# Altium schematic sheet Sensor.SchDoc
size A4
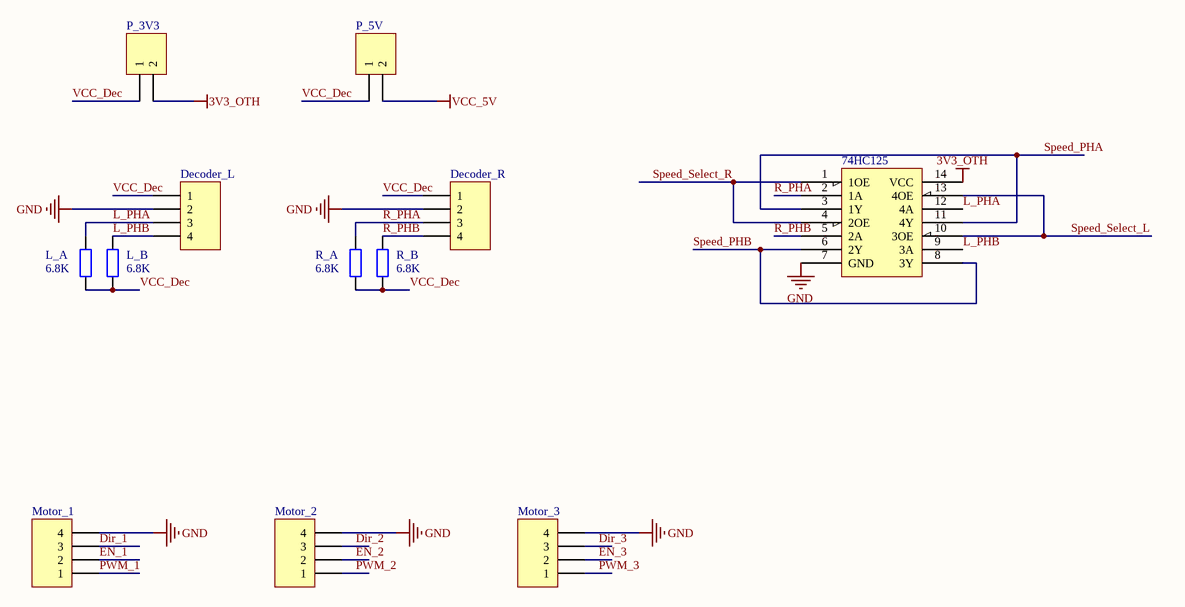
[diagram p0: Sensor.SchDoc]

## Parts
74HC125  74HC125  [751A-02_N]  (value not drawn)
Decoder_L  Header 4  [HDR1X4]  (value not drawn)
Decoder_R  Header 4  [HDR1X4]  (value not drawn)
L_A  6.8K  [0805-S]
L_B  6.8K  [0805-S]
Motor_1  Header 4  [HDR1X4]  (value not drawn)
Motor_2  Header 4  [HDR1X4]  (value not drawn)
Motor_3  Header 4  [HDR1X4]  (value not drawn)
P_3V3  Header 2  [HDR1X2]  (value not drawn)
P_5V  Header 2  [HDR1X2]  (value not drawn)
R_A  6.8K  [0805-S]
R_B  6.8K  [0805-S]

## Nets
3V3_OTH: 74HC125.14(VCC) P_3V3.2
GND: 74HC125.7(GND) Decoder_L.2 Decoder_R.2 Motor_1.4 Motor_2.4 Motor_3.4
VCC_5V: P_5V.2
Dir_1: Motor_1.3
Dir_2: Motor_2.3
Dir_3: Motor_3.3
EN_1: Motor_1.2
EN_2: Motor_2.2
EN_3: Motor_3.2
L_PHA: 74HC125.12(4A) Decoder_L.3 L_A.2
L_PHB: 74HC125.9(3A) Decoder_L.4 L_B.2
PWM_1: Motor_1.1
PWM_2: Motor_2.1
PWM_3: Motor_3.1
R_PHA: 74HC125.2(1A) Decoder_R.3 R_A.2
R_PHB: 74HC125.5(2A) Decoder_R.4 R_B.2
Speed_PHA: 74HC125.3(1Y) 74HC125.11(4Y)
Speed_PHB: 74HC125.6(2Y) 74HC125.8(3Y)
Speed_Select_L: 74HC125.10(3OE) 74HC125.13(4OE)
Speed_Select_R: 74HC125.1(1OE) 74HC125.4(2OE)
VCC_Dec: Decoder_L.1 Decoder_R.1 L_A.1 L_B.1 P_3V3.1 P_5V.1 R_A.1 R_B.1

## Library data of the parts
Decoder_L Decoder_R Motor_1-Motor_3 = Header 4: Header, 4-Pin; LatestRevisionDate: 17-Jul-2002; LatestRevisionNote: Re-released for DXP Platform.; Publisher: Altium Limited
L_A L_B R_A R_B = Res2_3: Resistor; Published: 8-Jun-2000; LatestRevisionDate: 17-Jul-2002; LatestRevisionNote: Re-released for DXP Platform.; PackageReference: AXIAL-0.4; Publisher: Altium Limited; Value: 6.8K
P_3V3 P_5V = Header 2: Header, 2-Pin; LatestRevisionDate: 17-Jul-2002; LatestRevisionNote: Re-released for DXP Platform.; Publisher: Altium Limited